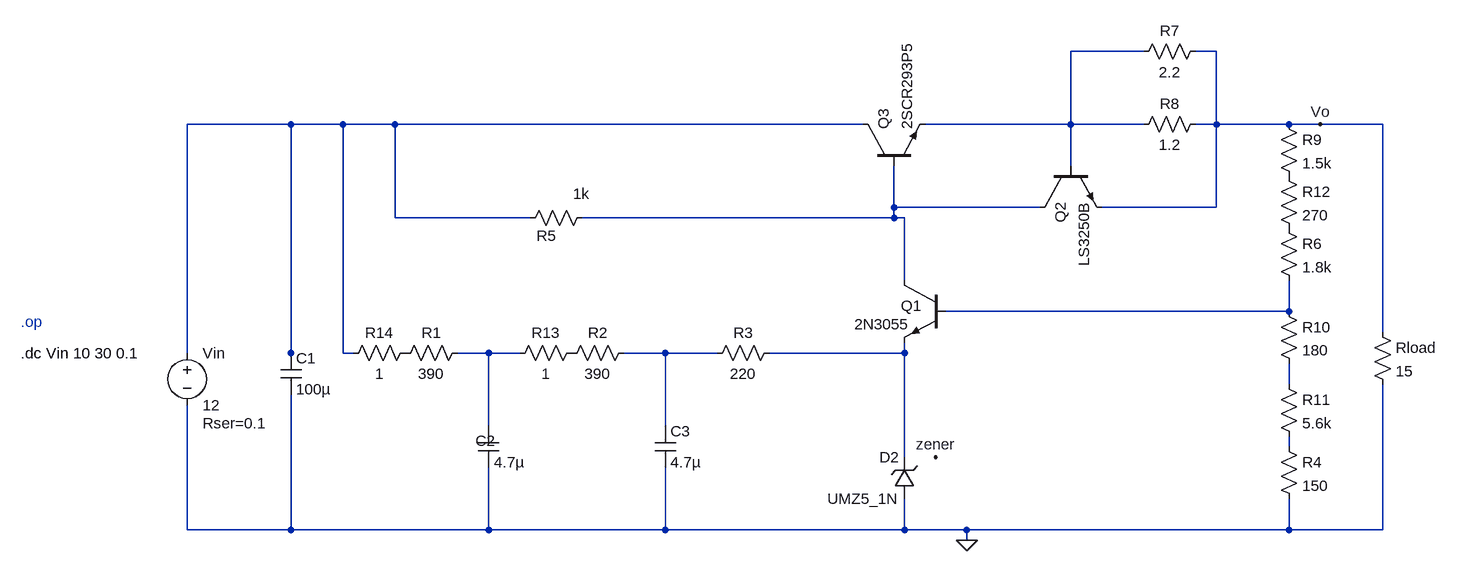
[diagram p0: schematic CEN304Phase1.asc]
CEN304Phase1.asc, the LTspice schematic file:
Version 4.1
SHEET 1 1684 680
WIRE 1168 -384 1056 -384
WIRE 1280 -384 1248 -384
WIRE -144 -272 -304 -272
WIRE -64 -272 -144 -272
WIRE 16 -272 -64 -272
WIRE 736 -272 16 -272
WIRE 1056 -272 1056 -384
WIRE 1056 -272 832 -272
WIRE 1168 -272 1056 -272
WIRE 1280 -272 1280 -384
WIRE 1280 -272 1248 -272
WIRE 1392 -272 1280 -272
WIRE 1440 -272 1392 -272
WIRE 1536 -272 1440 -272
WIRE 1056 -208 1056 -272
WIRE 784 -144 784 -208
WIRE 1008 -144 784 -144
WIRE 1280 -144 1280 -272
WIRE 1280 -144 1104 -144
WIRE 16 -128 16 -272
WIRE 224 -128 16 -128
WIRE 784 -128 784 -144
WIRE 784 -128 304 -128
WIRE 800 -128 784 -128
WIRE 800 -32 800 -128
WIRE 1392 16 1392 -32
WIRE 1392 16 864 16
WIRE 1536 48 1536 -272
WIRE -304 80 -304 -272
WIRE -144 80 -144 -272
WIRE -64 80 -64 -272
WIRE -48 80 -64 80
WIRE 160 80 112 80
WIRE 208 80 160 80
WIRE 432 80 368 80
WIRE 512 80 432 80
WIRE 800 80 800 64
WIRE 800 80 592 80
WIRE -144 96 -144 80
WIRE 1392 128 1392 96
WIRE 160 192 160 80
WIRE 432 192 432 80
WIRE 1392 224 1392 208
WIRE 800 240 800 80
WIRE -304 352 -304 160
WIRE -144 352 -144 144
WIRE -144 352 -304 352
WIRE 160 352 160 256
WIRE 160 352 -144 352
WIRE 432 352 432 256
WIRE 432 352 160 352
WIRE 800 352 800 304
WIRE 800 352 432 352
WIRE 896 352 800 352
WIRE 1392 352 1392 304
WIRE 1392 352 896 352
WIRE 1536 352 1536 128
WIRE 1536 352 1392 352
WIRE 896 368 896 352
FLAG 896 368 0
FLAG 1440 -272 Vo
FLAG 848 240 zener
SYMBOL voltage -304 64 R0
WINDOW 123 0 0 Left 0
WINDOW 39 24 124 Left 2
SYMATTR SpiceLine Rser=0.1
SYMATTR InstName Vin
SYMATTR Value 12
SYMBOL res 128 64 R90
WINDOW 0 0 56 VBottom 2
WINDOW 3 32 56 VTop 2
SYMATTR InstName R1
SYMATTR Value 390
SYMBOL res 384 64 R90
WINDOW 0 0 56 VBottom 2
WINDOW 3 32 56 VTop 2
SYMATTR InstName R2
SYMATTR Value 390
SYMBOL cap -160 80 R0
SYMATTR InstName C1
SYMATTR Value 100µ
SYMBOL cap 144 192 R0
WINDOW 0 -4 23 Left 2
SYMATTR InstName C2
SYMATTR Value 4.7µ
SYMBOL cap 416 192 R0
SYMATTR InstName C3
SYMATTR Value 4.7µ
SYMBOL zener 816 304 R180
WINDOW 0 24 64 Left 2
WINDOW 3 24 0 Left 2
SYMATTR InstName D2
SYMATTR Value UMZ5_1N
SYMBOL res 608 64 R90
WINDOW 0 0 56 VBottom 2
WINDOW 3 32 56 VTop 2
SYMATTR InstName R3
SYMATTR Value 220
SYMBOL res 1376 208 R0
SYMATTR InstName R4
SYMATTR Value 150
SYMBOL res 320 -144 R90
WINDOW 0 59 71 VBottom 2
WINDOW 3 -37 17 VTop 2
SYMATTR InstName R5
SYMATTR Value 1k
SYMBOL res 1376 -128 R0
SYMATTR InstName R6
SYMATTR Value 1.8k
SYMBOL res 1520 32 R0
SYMATTR InstName Rload
SYMATTR Value 15
SYMBOL res 1264 -288 R90
WINDOW 0 0 56 VBottom 2
WINDOW 3 32 56 VTop 2
SYMATTR InstName R8
SYMATTR Value 1.2
SYMBOL npn 864 -32 M0
WINDOW 0 37 39 Left 2
SYMATTR InstName Q1
SYMATTR Value 2N3055
SYMBOL npn 1008 -208 M90
SYMATTR InstName Q2
SYMATTR Value LS3250B
SYMBOL npn 736 -208 R270
SYMATTR InstName Q3
SYMATTR Value 2SCR293P5
SYMBOL res 1264 -400 R90
WINDOW 0 0 56 VBottom 2
WINDOW 3 32 56 VTop 2
SYMATTR InstName R7
SYMATTR Value 2.2
SYMBOL res 1376 -288 R0
SYMATTR InstName R9
SYMATTR Value 1.5k
SYMBOL res 1376 0 R0
SYMATTR InstName R10
SYMATTR Value 180
SYMBOL res 1376 112 R0
SYMATTR InstName R11
SYMATTR Value 5.6k
SYMBOL res 1376 -208 R0
SYMATTR InstName R12
SYMATTR Value 270
SYMBOL res 304 64 R90
WINDOW 0 0 56 VBottom 2
WINDOW 3 32 56 VTop 2
SYMATTR InstName R13
SYMATTR Value 1
SYMBOL res 48 64 R90
WINDOW 0 0 56 VBottom 2
WINDOW 3 32 56 VTop 2
SYMATTR InstName R14
SYMATTR Value 1
TEXT -560 80 Left 2 !.dc Vin 10 30 0.1
TEXT -560 32 Left 2 ;.op

The netlist it stands for:
* CEN304Phase1.asc
Vin N002 0 12 Rser=0.1
R1 N005 P001 390
R2 N006 P002 390
C1 N002 0 100µ
C2 N005 0 4.7µ
C3 N006 0 4.7µ
D2 0 N007 UMZ5_1N
R3 N007 N006 220
R4 N009 0 150
R5 N003 N002 1k
R6 P003 N004 1.8k
Rload Vo 0 15
R8 Vo N001 1.2
Q1 N003 N004 N007 0 2N3055
Q2 N003 N001 Vo 0 LS3250B
Q3 N002 N003 N001 0 2SCR293P5
R7 Vo N001 2.2
R9 Vo P004 1.5k
R10 N004 N008 180
R11 N008 N009 5.6k
R12 P004 P003 270
R13 P002 N005 1
R14 P001 N002 1
.model D D
.lib standard.dio
.model NPN NPN
.model PNP PNP
.lib standard.bjt
.dc Vin 10 30 0.1
* .op
.backanno
.end